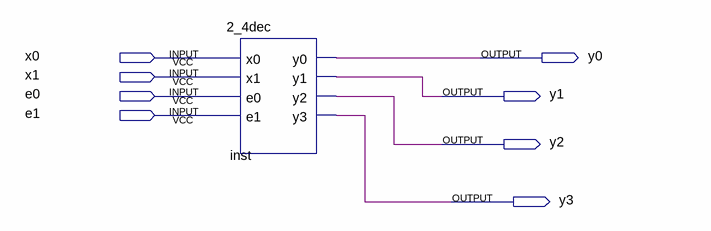
[diagram p0: schematic sheet]
// Quartus schematic DecoderDemo.bdf as structural Verilog: 1 symbols, 8 pins
module DecoderDemo (
  input  x0,
  input  x1,
  input  e0,
  input  e1,
  output y0,
  output y1,
  output y2,
  output y3
);

  \2_4dec  inst (.x0(x0), .x1(x1), .e0(e0), .e1(e1), .y0(y0), .y1(y1), .y2(y2), .y3(y3));
endmodule
